# Altium project nombre_por_definir.PrjPcb
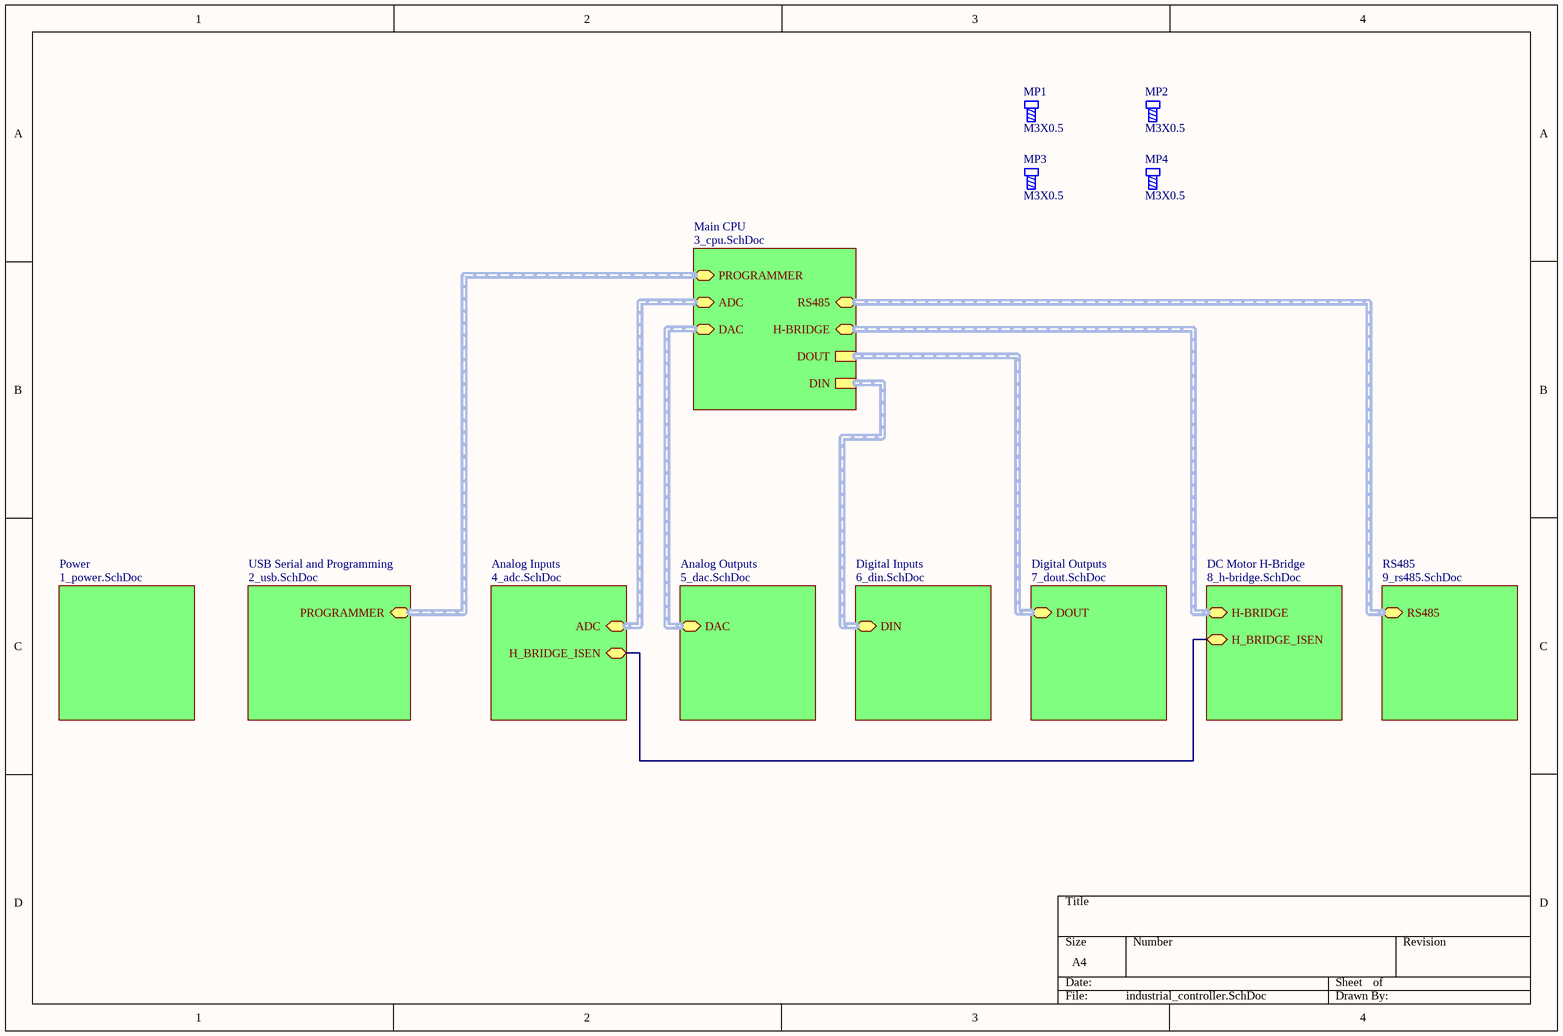
[diagram p0: industrial_controller.SchDoc]
10 sheets, 137 parts. Net scope: hierarchical (ports join the sheet entries above them; power ports are global).
Board file: nombre_por_definir.PcbDoc
Sheets:
  industrial_controller.SchDoc
    Main CPU = 3_cpu.SchDoc
    Analog Outputs = 5_dac.SchDoc
    Analog Inputs = 4_adc.SchDoc
    Power = 1_power.SchDoc
    RS485 = 9_rs485.SchDoc
    DC Motor H-Bridge = 8_h-bridge.SchDoc
    USB Serial and Programming = 2_usb.SchDoc
    Digital Inputs = 6_din.SchDoc
    Digital Outputs = 7_dout.SchDoc

## Sheet industrial_controller.SchDoc
size A4; DocumentNumber: 1; SheetNumber: 1; SheetTotal: 10

### Parts
MP1  M3X0.5  [SCREW-M3]  (no BOM)
MP2  M3X0.5  [SCREW-M3]  (no BOM)
MP3  M3X0.5  [SCREW-M3]  (no BOM)
MP4  M3X0.5  [SCREW-M3]  (no BOM)

### Sub-sheets
Analog Inputs = 4_adc.SchDoc: ADC (bidir, harness ADC), H_BRIDGE_ISEN (bidir)
Analog Outputs = 5_dac.SchDoc: DAC (bidir, harness DAC)
DC Motor H-Bridge = 8_h-bridge.SchDoc: H-BRIDGE (bidir, harness DC Motor H-Bridge), H_BRIDGE_ISEN (bidir)
Digital Inputs = 6_din.SchDoc: DIN (bidir, harness Digital Inputs)
Digital Outputs = 7_dout.SchDoc: DOUT (bidir, harness Digital Outputs)
Main CPU = 3_cpu.SchDoc: PROGRAMMER (bidir, harness ESP32 Programmer), RS485 (bidir, harness RS485), DAC (bidir, harness DAC), ADC (bidir, harness ADC), H-BRIDGE (bidir, harness DC Motor H-Bridge), DOUT (harness Digital Outputs), DIN (harness Digital Inputs)
Power = 1_power.SchDoc: no entries
RS485 = 9_rs485.SchDoc: RS485 (bidir, harness RS485)
USB Serial and Programming = 2_usb.SchDoc: PROGRAMMER (bidir, harness ESP32 Programmer)

### Nets
H_BRIDGE_ISEN: sheet Analog Inputs/H_BRIDGE_ISEN, sheet DC Motor H-Bridge/H_BRIDGE_ISEN

### Buses and harness runs
harness sheet Analog Inputs/ADC = sheet Main CPU/ADC
harness sheet Analog Outputs/DAC = sheet Main CPU/DAC
harness sheet DC Motor H-Bridge/H-BRIDGE = sheet Main CPU/H-BRIDGE
harness sheet Digital Inputs/DIN = sheet Main CPU/DIN
harness sheet Digital Outputs/DOUT = sheet Main CPU/DOUT
harness sheet Main CPU/PROGRAMMER = sheet USB Serial and Programming/PROGRAMMER
harness sheet Main CPU/RS485 = sheet RS485/RS485

### Library data of the parts
MP1-MP4 = SCREW-M3: Mach screw M3X0.5; Category: Accesories

## Sheet 3_cpu.SchDoc: Microcontroller
size A4; DocumentNumber: 4; SheetNumber: 4; SheetTotal: 11
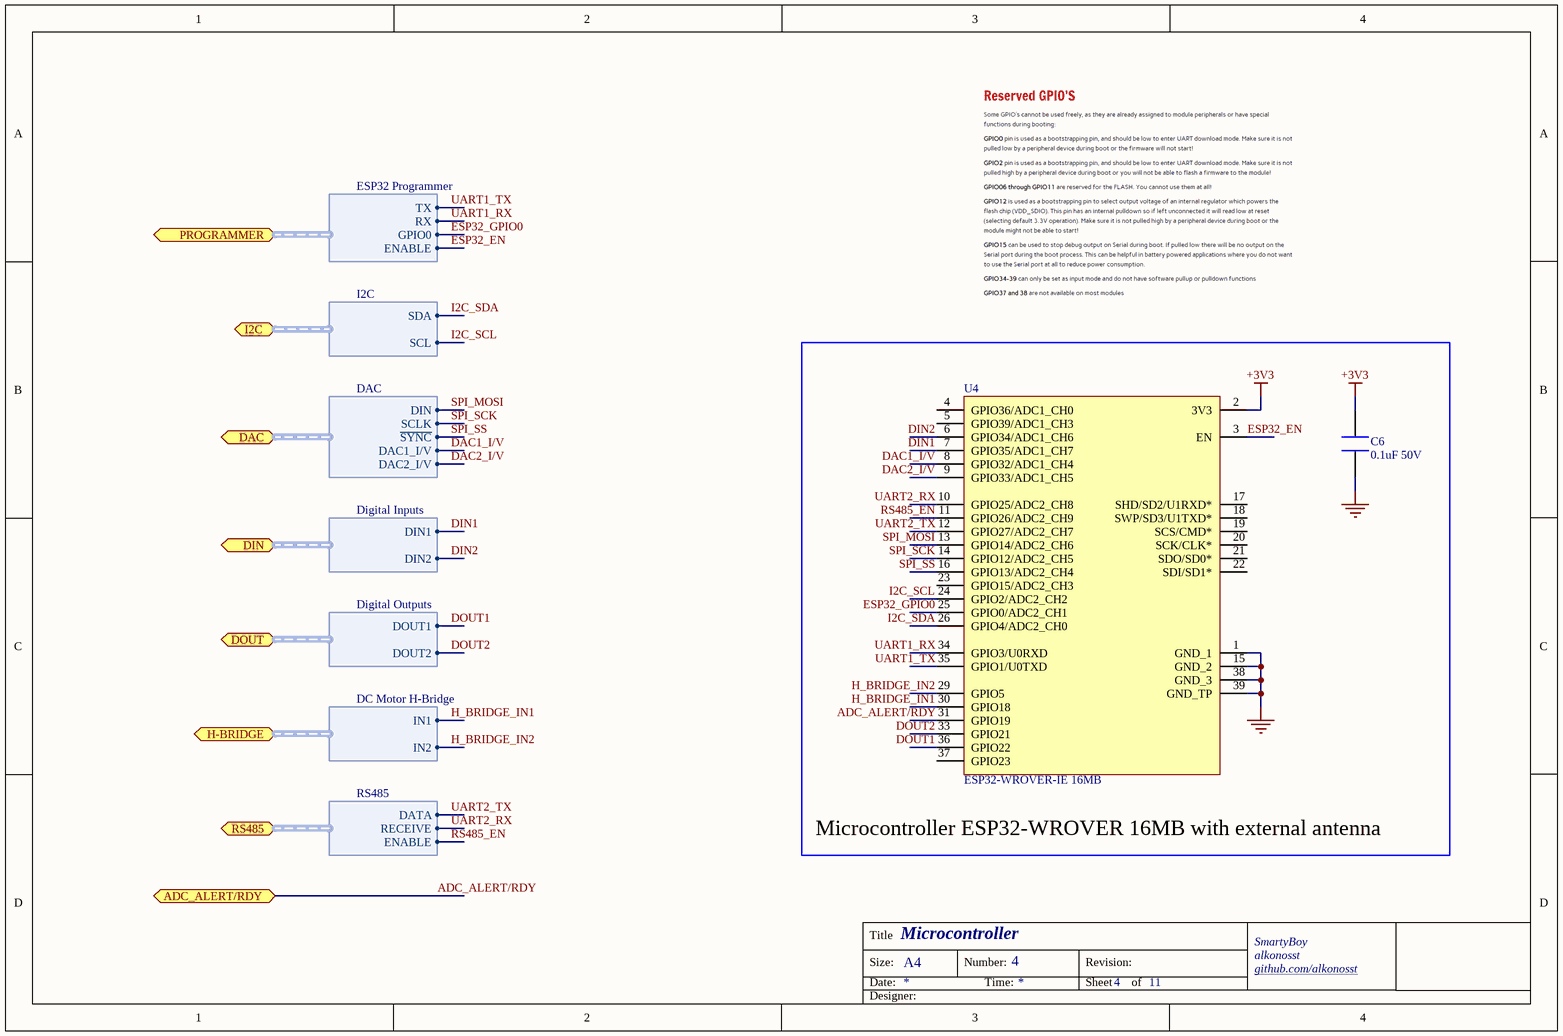
[diagram p1: 3_cpu.SchDoc]

### Parts
C6  0.1uF 50V  [C0603]
U4  ESP32-WROVER-IE 16MB  [ESP32-WROVER-IE]

### Blocks framed on the sheet
Microcontroller ESP32-WROVER 16MB with external antenna: C6 U4

### Ports
ADC_ALERT/RDY (bidir), DAC (bidir, harness DAC), DIN (bidir, harness Digital Inputs), DOUT (bidir, harness Digital Outputs), H-BRIDGE (bidir, harness DC Motor H-Bridge), I2C (bidir, harness I2C), PROGRAMMER (bidir, harness ESP32 Programmer), RS485 (bidir, harness RS485)

### Harnesses
ESP32 Programmer: TX, RX, GPIO0, ENABLE
RS485: DATA, RECEIVE, ENABLE
DAC: DIN, SCLK, ~{SYNC}, DAC1_I/V, DAC2_I/V
DC Motor H-Bridge: IN1, IN2
Digital Inputs: DIN1, DIN2
Digital Outputs: DOUT1, DOUT2
I2C: SDA, SCL

### Nets
+3V3: C6.1 U4.2(3V3)
GND: C6.2 U4.1(GND_1) U4.15(GND_2) U4.38(GND_3) U4.39(GND_TP)
ADC_ALERT/RDY: U4.31(GPIO19) ; port ADC_ALERT/RDY
DAC1_I/V: U4.8(GPIO32/ADC1_CH4) ; port DAC.DAC1_I/V
DAC2_I/V: U4.9(GPIO33/ADC1_CH5) ; port DAC.DAC2_I/V
DIN1: U4.7(GPIO35/ADC1_CH7) ; port DIN.DIN1
DIN2: U4.6(GPIO34/ADC1_CH6) ; port DIN.DIN2
DOUT1: U4.36(GPIO22) ; port DOUT.DOUT1
DOUT2: U4.33(GPIO21) ; port DOUT.DOUT2
ESP32_EN: U4.3(EN) ; port PROGRAMMER.ENABLE
ESP32_GPIO0: U4.25(GPIO0/ADC2_CH1) ; port PROGRAMMER.GPIO0
H_BRIDGE_IN1: U4.30(GPIO18) ; port H-BRIDGE.IN1
H_BRIDGE_IN2: U4.29(GPIO5) ; port H-BRIDGE.IN2
I2C_SCL: U4.24(GPIO2/ADC2_CH2) ; port I2C.SCL
I2C_SDA: U4.26(GPIO4/ADC2_CH0) ; port I2C.SDA
RS485_EN: U4.11(GPIO26/ADC2_CH9) ; port RS485.ENABLE
SPI_MOSI: U4.13(GPIO14/ADC2_CH6) ; port DAC.DIN
SPI_SCK: U4.14(GPIO12/ADC2_CH5) ; port DAC.SCLK
SPI_SS: U4.16(GPIO13/ADC2_CH4) ; port DAC.~{SYNC}
UART1_RX: U4.34(GPIO3/U0RXD) ; port PROGRAMMER.RX
UART1_TX: U4.35(GPIO1/U0TXD) ; port PROGRAMMER.TX
UART2_RX: U4.10(GPIO25/ADC2_CH8) ; port RS485.RECEIVE
UART2_TX: U4.12(GPIO27/ADC2_CH7) ; port RS485.DATA

Not connected (* = marked no-connect by the designer): U4 4(GPIO36/ADC1_CH0) 5(GPIO39/ADC1_CH3) 17(SHD/SD2/U1RXD*) 18(SWP/SD3/U1TXD*) 19(SCS/CMD*) 20(SCK/CLK*) 21(SDO/SD0*) 22(SDI/SD1*) 23(GPIO15/ADC2_CH3) 37(GPIO23)

### Notes on the sheet
- Title
- Size:
- Date:
- A4
- Number:
- Time:
- Revision:
- Sheet
- of
- SmartyBoy
- alkonosst
- github.com/alkonosst <http://github.com/alkonosst>
- Designer:

### Library data of the parts
C6 = CC0603KRX7R9BB104: X7R 100nF ±10% 50V 0603 Multilayer Ceramic Capacitors MLCC - SMD/SMT; LCSC part: C14663; Category: Capacitors: Multilayer Ceramic Capacitors MLCC - SMD/SMT
U4 = ESP32-WROVER-IE(16MB): RX TXRX MOD WIFI EXT IPEX SMD; LCSC part: C701352; Category: IoT/Communication Modules: WiFi Modules

## Sheet 5_dac.SchDoc: Analog Outputs
size A4; DocumentNumber: 6; SheetNumber: 6; SheetTotal: 11
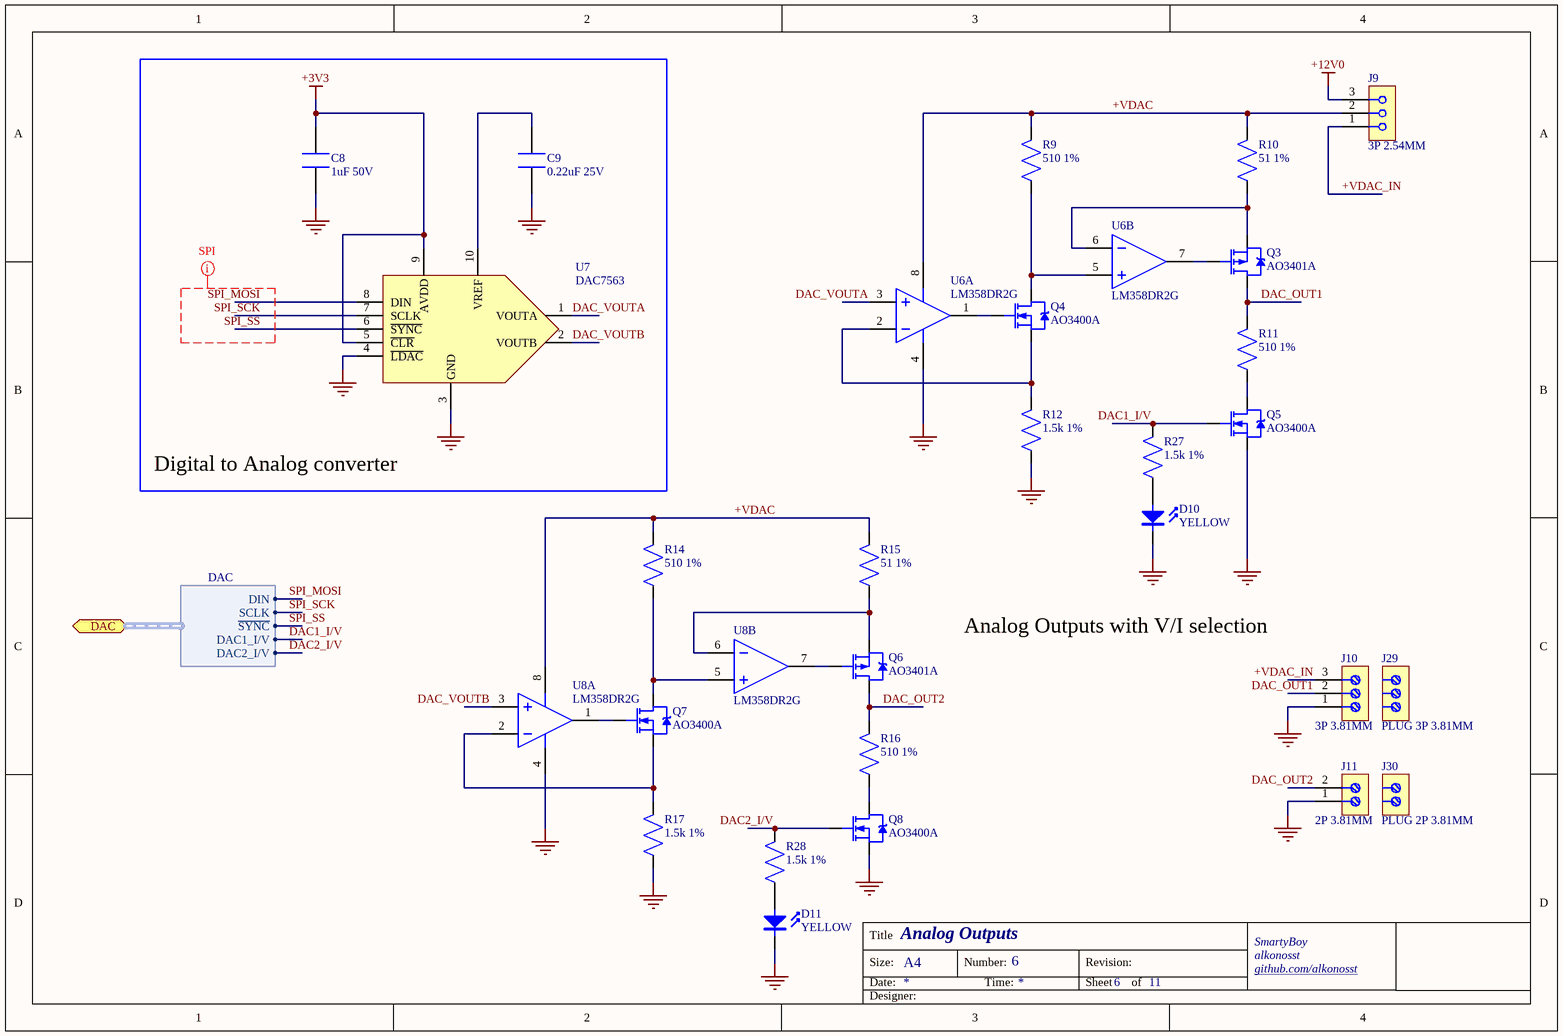
[diagram p2: 5_dac.SchDoc]

### Parts
C8  1uF 50V  [C0603]
C9  0.22uF 25V  [C0603]
D10  YELLOW  [LED0603-YELLOW]
D11  YELLOW  [LED0603-YELLOW]
J9  3P 2.54MM  [HDR-M-3P-2.54MM]
J10  3P 3.81MM  [TB-3P-3.81MM]  (no BOM)
J11  2P 3.81MM  [TB-2P-3.81MM]  (no BOM)
J29  PLUG 3P 3.81MM  [TB-PLUG-3P-3.81MM]  (no BOM)
J30  PLUG 2P 3.81MM  [TB-PLUG-2P-3.81MM]  (no BOM)
Q3  AO3401A  [SOT-23-3]
Q4  AO3400A  [SOT-23-3]
Q5  AO3400A  [SOT-23-3]
Q6  AO3401A  [SOT-23-3]
Q7  AO3400A  [SOT-23-3]
Q8  AO3400A  [SOT-23-3]
R9  510 1%  [R0603]
R10  51 1%  [R0603]
R11  510 1%  [R0603]
R12  1.5k 1%  [R0603]
R14  510 1%  [R0603]
R15  51 1%  [R0603]
R16  510 1%  [R0603]
R17  1.5k 1%  [R0603]
R27  1.5k 1%  [R0603]
R28  1.5k 1%  [R0603]
U6  LM358DR2G  [SOIC-8]  (parts A,B of 2)
U7  DAC7563  [VSSOP-10]
U8  LM358DR2G  [SOIC-8]  (parts A,B of 2)

### Blocks framed on the sheet
Digital to Analog converter: C8 C9 U7

### Ports
DAC (bidir, harness DAC)

### Harnesses
DAC: DIN, SCLK, ~{SYNC}, DAC1_I/V, DAC2_I/V

### Nets
+3V3: C8.1 U7.5(~{CLR}) U7.9(AVDD)
+12V0: J9.3
GND: C8.2 C9.2 D10.1 D11.1 J10.1 J11.1 Q5.2(S) Q8.2(S) R12.1 R17.1 U6.4(VSS) U7.3(GND) U7.4(~{LDAC}) U8.4(VSS)
+VDAC: J9.2 R9.2 R10.2 R14.2 R15.2 U6.8(VDD) U8.8(VDD)
+VDAC_IN: J9.1 J10.3
DAC1_I/V: Q5.1(G) R27.2 ; port DAC.DAC1_I/V
DAC2_I/V: Q8.1(G) R28.2 ; port DAC.DAC2_I/V
DAC_OUT1: J10.2 Q3.3(D) R11.2
DAC_OUT2: J11.2 Q6.3(D) R16.2
DAC_VOUTA: U6.3(IN1+) U7.1(VOUTA)
DAC_VOUTB: U7.2(VOUTB) U8.3(IN1+)
SPI_MOSI: U7.8(DIN) ; port DAC.DIN
SPI_SCK: U7.7(SCLK) ; port DAC.SCLK
SPI_SS: U7.6(~{SYNC}) ; port DAC.~{SYNC}
NetC9_1: C9.1 U7.10(VREF)
NetD10_2: D10.2 R27.1
NetD11_2: D11.2 R28.1
NetQ3_1: Q3.1(G) U6.7(OUT2)
NetQ3_2: Q3.2(S) R10.1 U6.6(IN2-)
NetQ4_1: Q4.1(G) U6.1(OUT1)
NetQ4_2: Q4.2(S) R12.2 U6.2(IN1-)
NetQ4_3: Q4.3(D) R9.1 U6.5(IN2+)
NetQ5_3: Q5.3(D) R11.1
NetQ6_1: Q6.1(G) U8.7(OUT2)
NetQ6_2: Q6.2(S) R15.1 U8.6(IN2-)
NetQ7_1: Q7.1(G) U8.1(OUT1)
NetQ7_2: Q7.2(S) R17.2 U8.2(IN1-)
NetQ7_3: Q7.3(D) R14.1 U8.5(IN2+)
NetQ8_3: Q8.3(D) R16.1

### Layout directives
net class SPI: SPI_MOSI, SPI_SCK, SPI_SS

### Notes on the sheet
- (near J10) Analog Outputs with V/I selection
- Title
- Size:
- Date:
- A4
- Number:
- Time:
- Revision:
- Sheet
- of
- SmartyBoy
- alkonosst
- github.com/alkonosst <http://github.com/alkonosst>
- Designer:

### Library data of the parts
C8 = CL10A105KB8NNNC: X5R ±10% 50V 1uF 0603 Multilayer Ceramic Capacitors MLCC - SMD/SMT; LCSC part: C15849; Category: Capacitors: Multilayer Ceramic Capacitors MLCC - SMD/SMT
C9 = CL10B224KA8NNNC: X7R 25V ±10% 220nF 0603 Multilayer Ceramic Capacitors MLCC - SMD/SMT; LCSC part: C21120; Category: Capacitors: Multilayer Ceramic Capacitors MLCC - SMD/SMT
D10 D11 = 19-213/Y2C-CQ2R2L/3T(CY): Yellow 585.5~591.5nm 0603 Light Emitting Diodes (LED); LCSC part: C72038; Category: Optoelectronics: Light Emitting Diodes (LED)
J9 = C49257: 3 2.54mm Straight 1 Header，Breakaway Through Hole Pin Header & Female Header; LCSC part: C49257; Category: Connectors: Pin Header & Female Header
J10 = TBLOCK-3P-3.81MM: Terminal Block 3 Positions 3.81MM; Category: Connectors: Pluggable System Terminal Block
J11 = TBLOCK-2P-3.81MM: Terminal Block 2 Positions 3.81MM; Category: Connectors: Pluggable System Terminal Block
J29 = PLUG-3P-3.81MM: Terminal block plug 3positions 3.81mm; Category: Connectors: Pluggable System Terminal Block
J30 = PLUG-2P-3.81MM: Terminal block plug 2positions 3.81mm; Category: Connectors: Pluggable System Terminal Block
Q3 Q6 = AO3401A: 1.4W 0.044Ω 4.3A,10V 30V 1.3V 250uA P Channel 4A SOT-23-3L MOSFETs; Category: Transistors: MOSFETs; LCSC part: C15127
Q4 Q5 Q7 Q8 = AO3400A: 1.4W 0.0265Ω 5.7A,10V 30V 5.7A N Channel 1.5V 250uA SOT-23-3L MOSFETs; LCSC part: C20917; Category: Transistors: MOSFETs
R9 R11 R14 R16 = 0603WAF5100T5E: 510Ω ±1% ±100ppm/℃ 0.1W 0603 Chip Resistor - Surface Mount; LCSC part: C23193; Category: Resistors: Chip Resistor - Surface Mount
R10 R15 = 0603WAF510JT5E: ±1% ±200ppm/℃ 0.1W 51Ω 0603 Chip Resistor - Surface Mount; LCSC part: C23197; Category: Resistors: Chip Resistor - Surface Mount
R12 R17 R27 R28 = 0603WAF1501T5E: 1.5kΩ ±1% ±100ppm/℃ 0.1W 0603 Chip Resistor - Surface Mount; LCSC part: C22843; Category: Resistors: Chip Resistor - Surface Mount
U6 U8 = LM358DR2G: 1MHz 2 General Purpose 1.5mA 0.6 V/us 3V ~ 32V, ±1.5V ~ 16V SOIC-8_150mil General Purpose Amplifiers; Category: Amplifiers: General Purpose Amplifiers; LCSC part: C7950
U7 = DAC7563SDGSR: VSSOP-10 Digital To Analog Converters (DACs); LCSC part: C601656; Category: Data Converters: Digital To Analog Converters (DACs)

## Sheet 4_adc.SchDoc: Analog Inputs
size A4; DocumentNumber: 5; SheetNumber: 5; SheetTotal: 11
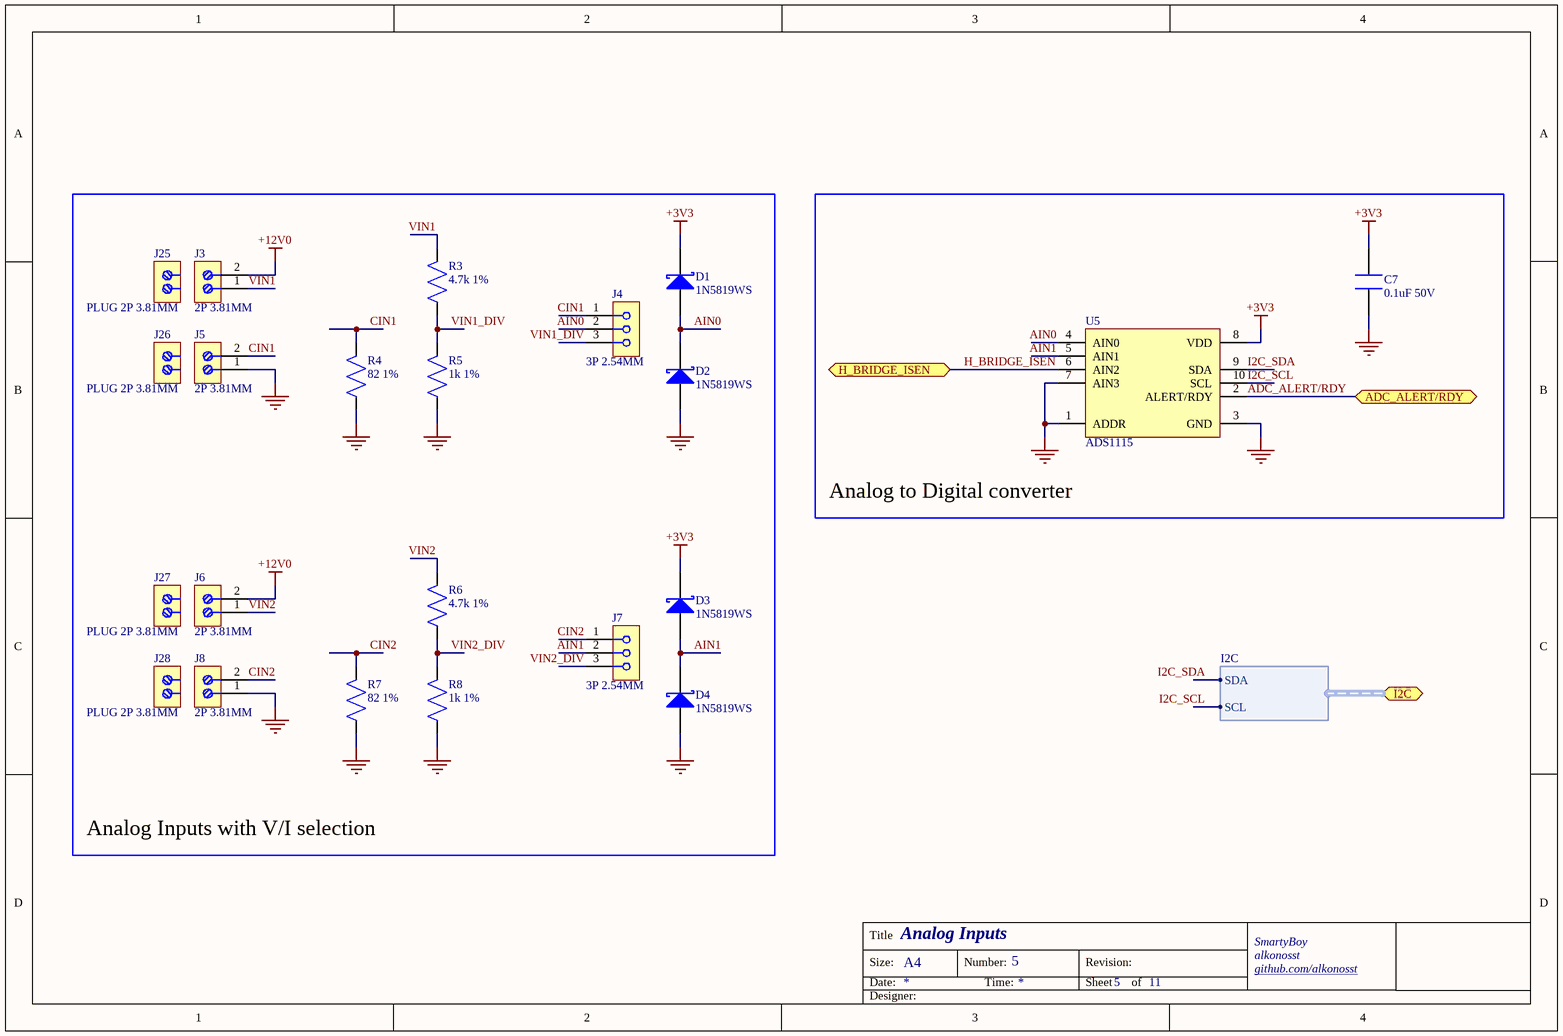
[diagram p3: 4_adc.SchDoc]

### Parts
C7  0.1uF 50V  [C0603]
D1  1N5819WS  [SOD-323]
D2  1N5819WS  [SOD-323]
D3  1N5819WS  [SOD-323]
D4  1N5819WS  [SOD-323]
J3  2P 3.81MM  [TB-2P-3.81MM]  (no BOM)
J4  3P 2.54MM  [HDR-M-3P-2.54MM]
J5  2P 3.81MM  [TB-2P-3.81MM]  (no BOM)
J6  2P 3.81MM  [TB-2P-3.81MM]  (no BOM)
J7  3P 2.54MM  [HDR-M-3P-2.54MM]
J8  2P 3.81MM  [TB-2P-3.81MM]  (no BOM)
J25  PLUG 2P 3.81MM  [TB-PLUG-2P-3.81MM]  (no BOM)
J26  PLUG 2P 3.81MM  [TB-PLUG-2P-3.81MM]  (no BOM)
J27  PLUG 2P 3.81MM  [TB-PLUG-2P-3.81MM]  (no BOM)
J28  PLUG 2P 3.81MM  [TB-PLUG-2P-3.81MM]  (no BOM)
R3  4.7k 1%  [R0603]
R4  82 1%  [R0603]
R5  1k 1%  [R0603]
R6  4.7k 1%  [R0603]
R7  82 1%  [R0603]
R8  1k 1%  [R0603]
U5  ADS1115  [MSOP-10]

### Blocks framed on the sheet
Analog Inputs with V/I selection: D1-D4 J3-J8 J25-J28 R3-R8
Analog to Digital converter: C7 U5

### Ports
ADC_ALERT/RDY (bidir), H_BRIDGE_ISEN (bidir), I2C (bidir, harness I2C)

### Harnesses
I2C: SDA, SCL

### Nets
+3V3: C7.1 D1.1(K) D3.1(K) U5.8(VDD)
+12V0: J3.2 J6.2
GND: C7.2 D2.2(A) D4.2(A) J5.1 J8.1 R4.1 R5.1 R7.1 R8.1 U5.1(ADDR) U5.3(GND) U5.7(AIN3)
ADC_ALERT/RDY: U5.2(ALERT/RDY) ; port ADC_ALERT/RDY
AIN0: D1.2(A) D2.1(K) J4.2 U5.4(AIN0)
AIN1: D3.2(A) D4.1(K) J7.2 U5.5(AIN1)
CIN1: J4.1 J5.2 R4.2
CIN2: J7.1 J8.2 R7.2
H_BRIDGE_ISEN: U5.6(AIN2) ; port H_BRIDGE_ISEN
I2C_SCL: U5.10(SCL) ; port I2C.SCL
I2C_SDA: U5.9(SDA) ; port I2C.SDA
VIN1: J3.1 R3.2
VIN1_DIV: J4.3 R3.1 R5.2
VIN2: J6.1 R6.2
VIN2_DIV: J7.3 R6.1 R8.2

### Notes on the sheet
- Title
- Size:
- Date:
- A4
- Number:
- Time:
- Revision:
- Sheet
- of
- SmartyBoy
- alkonosst
- github.com/alkonosst <http://github.com/alkonosst>
- Designer:

### Library data of the parts
C7 = CC0603KRX7R9BB104: as C6 on sheet 3_cpu; LCSC part: C14663; Category: Capacitors: Multilayer Ceramic Capacitors MLCC - SMD/SMT
D1-D4 = 1N5819WS: 40V 1A 600mV @ 1A SOD-323 Schottky Barrier Diodes (SBD); LCSC part: C191023; Category: Diodes: Schottky Barrier Diodes (SBD)
J3 J5 J6 J8 = TBLOCK-2P-3.81MM: Terminal Block 2 Positions 3.81MM; Category: Connectors: Pluggable System Terminal Block
J4 J7 = C49257: as J9 on sheet 5_dac; LCSC part: C49257; Category: Connectors: Pin Header & Female Header
J25-J28 = PLUG-2P-3.81MM: Terminal block plug 2positions 3.81mm; Category: Connectors: Pluggable System Terminal Block
R3 R6 = 0603WAF4701T5E: ±1% 4.7kΩ ±100ppm/℃ 0.1W 0603 Chip Resistor - Surface Mount; LCSC part: C23162; Category: Resistors: Chip Resistor - Surface Mount
R4 R7 = 0603WAF820JT5E: 82Ω ±1% ±200ppm/℃ 0.1W 0603 Chip Resistor - Surface Mount; LCSC part: C23255; Category: Resistors: Chip Resistor - Surface Mount
R5 R8 = 0603WAF1001T5E: ±1% ±100ppm/℃ 1kΩ 0.1W 0603 Chip Resistor - Surface Mount; LCSC part: C21190; Category: Resistors: Chip Resistor - Surface Mount
U5 = ADS1115IDGSR: 2,4 Differential, Single Ended 16 860 VSSOP-10 Analog To Digital Converters (ADCs); LCSC part: C37593; Category: Data Converters: Analog To Digital Converters (ADCs)

## Sheet 1_power.SchDoc: Power
size A4; DocumentNumber: 2; SheetNumber: 2; SheetTotal: 11
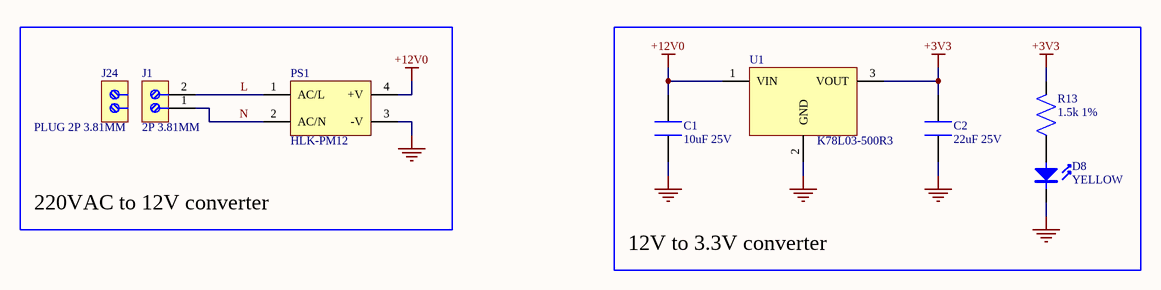
[diagram p4: 1_power.SchDoc]

### Parts
C1  10uF 25V  [C0805]
C2  22uF 25V  [C0805]
D8  YELLOW  [LED0603-YELLOW]
J1  2P 3.81MM  [TB-2P-3.81MM]  (no BOM)
J24  PLUG 2P 3.81MM  [TB-PLUG-2P-3.81MM]  (no BOM)
PS1  HLK-PM12  [HLK-PM12]
R13  1.5k 1%  [R0603]
U1  K78L03-500R3  [K78LXX-500R3]

### Blocks framed on the sheet
220VAC to 12V converter: J1 J24 PS1
12V to 3.3V converter: C1 C2 D8 R13 U1

### Nets
+3V3: C2.1 R13.2 U1.3(VOUT)
+12V0: C1.1 PS1.4(+V) U1.1(VIN)
GND: C1.2 C2.2 D8.1 PS1.3(-V) U1.2(GND)
L: J1.2 PS1.1(AC/L)
N: J1.1 PS1.2(AC/N)
NetD8_2: D8.2 R13.1

### Notes on the sheet
- Title
- Size:
- Date:
- A4
- Number:
- Time:
- Revision:
- Sheet
- of
- SmartyBoy
- alkonosst
- github.com/alkonosst <http://github.com/alkonosst>
- Designer:

### Library data of the parts
C1 = CL21A106KAYNNNE: X5R 25V ±10% 10uF 0805 Multilayer Ceramic Capacitors MLCC - SMD/SMT; LCSC part: C15850; Category: Capacitors: Multilayer Ceramic Capacitors MLCC - SMD/SMT
C2 = CL21A226MAQNNNE: X5R 25V ±20% 22uF 0805 Multilayer Ceramic Capacitors MLCC - SMD/SMT; LCSC part: C45783; Category: Capacitors: Multilayer Ceramic Capacitors MLCC - SMD/SMT
D8 = 19-213/Y2C-CQ2R2L/3T(CY): as D10 on sheet 5_dac; LCSC part: C72038; Category: Optoelectronics: Light Emitting Diodes (LED)
J1 = TBLOCK-2P-3.81MM: Terminal Block 2 Positions 3.81MM; Category: Connectors: Pluggable System Terminal Block
J24 = PLUG-2P-3.81MM: Terminal block plug 2positions 3.81mm; Category: Connectors: Pluggable System Terminal Block
PS1 = HLK-PM12: 220VAC to 12VDC Power Module 3W; LCSC part: C209905; Category: Power Management ICs: Power Modules
R13 = 0603WAF1501T5E: as R12 on sheet 5_dac; LCSC part: C22843; Category: Resistors: Chip Resistor - Surface Mount
U1 = K78L03-500R3: 36V 500mA 3.3V 1 SIP Power Modules; LCSC part: C115818; Category: Power Management ICs: Power Modules

## Sheet 9_rs485.SchDoc: RS485 Bus
size A4; DocumentNumber: 10; SheetNumber: 10; SheetTotal: 11
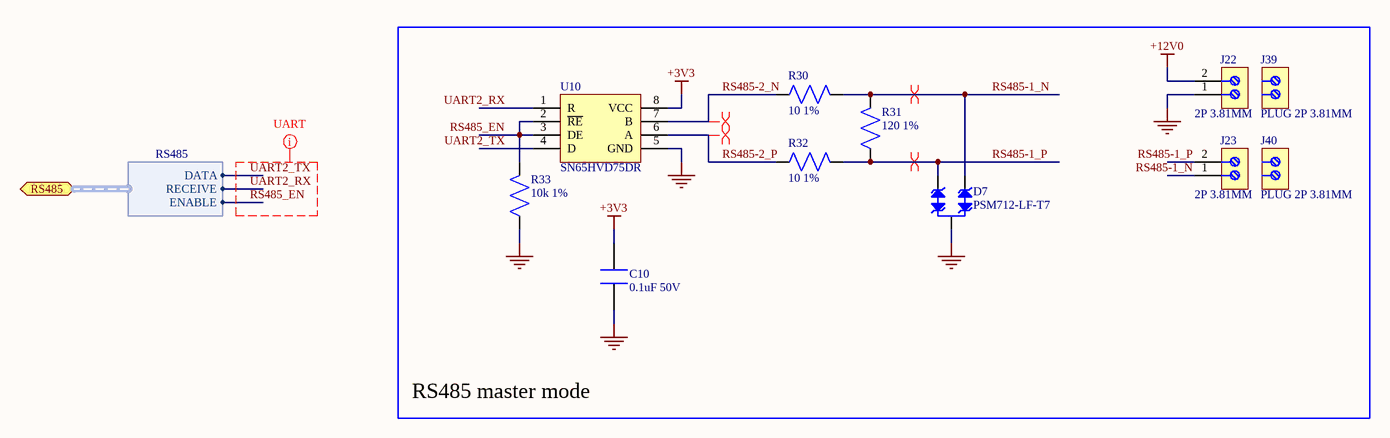
[diagram p5: 9_rs485.SchDoc]

### Parts
C10  0.1uF 50V  [C0603]
D7  PSM712-LF-T7  [SOT-23-3]
J22  2P 3.81MM  [TB-2P-3.81MM]  (no BOM)
J23  2P 3.81MM  [TB-2P-3.81MM]  (no BOM)
J39  PLUG 2P 3.81MM  [TB-PLUG-2P-3.81MM]  (no BOM)
J40  PLUG 2P 3.81MM  [TB-PLUG-2P-3.81MM]  (no BOM)
R30  10 1%  [R0603]
R31  120 1%  [R0603]
R32  10 1%  [R0603]
R33  10k 1%  [R0603]
U10  SN65HVD75DR  [SOIC-8]

### Blocks framed on the sheet
RS485 master mode: C10 D7 J22 J23 J39 J40 R30-R33 U10

### Ports
RS485 (bidir, harness RS485)

### Harnesses
RS485: DATA, RECEIVE, ENABLE

### Nets
+3V3: C10.1 U10.8(VCC)
+12V0: J22.2
GND: C10.2 D7.3 J22.1 R33.1 U10.5(GND)
RS485-1_N: D7.2 J23.1 R30.2 R31.2
RS485-1_P: D7.1 J23.2 R31.1 R32.2
RS485-2_N: R30.1 U10.7(B)
RS485-2_P: R32.1 U10.6(A)
RS485_EN: R33.2 U10.2(~{RE}) U10.3(DE) ; port RS485.ENABLE
UART2_RX: U10.1(R) ; port RS485.RECEIVE
UART2_TX: U10.4(D) ; port RS485.DATA

### Layout directives
differential pair: RS485-1_N, RS485-1_P, RS485-2_N, RS485-2_P
net class UART: RS485_EN, UART2_RX, UART2_TX

### Notes on the sheet
- Title
- Size:
- Date:
- A4
- Number:
- Time:
- Revision:
- Sheet
- of
- SmartyBoy
- alkonosst
- github.com/alkonosst <http://github.com/alkonosst>
- Designer:

### Library data of the parts
C10 = CC0603KRX7R9BB104: as C6 on sheet 3_cpu; LCSC part: C14663; Category: Capacitors: Multilayer Ceramic Capacitors MLCC - SMD/SMT
D7 = PSM712-LF-T7: Bidirectional - 19V 13.3V 12V SOT-23(SOT-23-3) TVS; Category: Diodes: TVS; LCSC part: C32677
J22 J23 = TBLOCK-2P-3.81MM: Terminal Block 2 Positions 3.81MM; Category: Connectors: Pluggable System Terminal Block
J39 J40 = PLUG-2P-3.81MM: Terminal block plug 2positions 3.81mm; Category: Connectors: Pluggable System Terminal Block
R30 R32 = 0603WAF100JT5E: ±1% ±400ppm/℃ 10Ω 0.1W 0603 Chip Resistor - Surface Mount; LCSC part: C22859; Category: Resistors: Chip Resistor - Surface Mount
R31 = 0603WAF1200T5E: ±1% ±100ppm/℃ 120Ω 0.1W 0603 Chip Resistor - Surface Mount; LCSC part: C22787; Category: Resistors: Chip Resistor - Surface Mount
R33 = 0603WAF1002T5E: ±1% ±100ppm/℃ 10kΩ 0.1W 0603 Chip Resistor - Surface Mount; LCSC part: C25804; Category: Resistors: Chip Resistor - Surface Mount
U10 = SN65HVD75DR: Transceiver 1/1 RS422, RS485 20Mbps SOIC-8_150mil RS-485/RS-422 ICs; LCSC part: C57928; Category: Interface ICs: RS-485/RS-422 ICs

## Sheet 8_h-bridge.SchDoc: H-Bridge DC Motor
size A4; DocumentNumber: 9; SheetNumber: 9; SheetTotal: 11
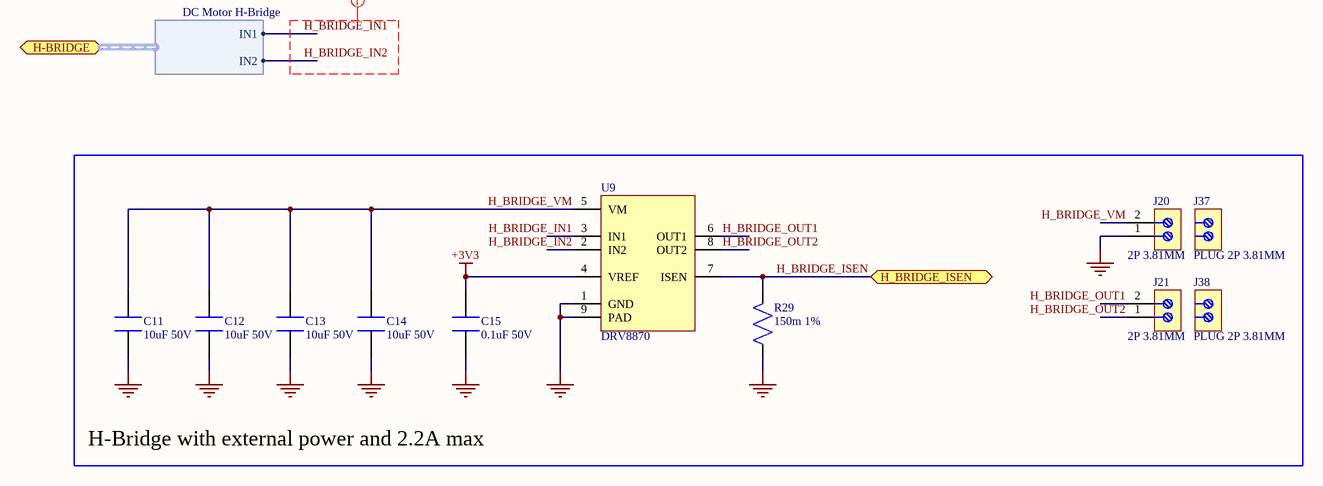
[diagram p6: 8_h-bridge.SchDoc]

### Parts
C11  10uF 50V  [C0805]
C12  10uF 50V  [C0805]
C13  10uF 50V  [C0805]
C14  10uF 50V  [C0805]
C15  0.1uF 50V  [C0603]
J20  2P 3.81MM  [TB-2P-3.81MM]  (no BOM)
J21  2P 3.81MM  [TB-2P-3.81MM]  (no BOM)
J37  PLUG 2P 3.81MM  [TB-PLUG-2P-3.81MM]  (no BOM)
J38  PLUG 2P 3.81MM  [TB-PLUG-2P-3.81MM]  (no BOM)
R29  150m 1%  [R2512]
U9  DRV8870  [HSOP-8]

### Blocks framed on the sheet
H-Bridge with external power and 2.2A max: C11-C15 J20 J21 J37 J38 R29 U9

### Ports
H-BRIDGE (bidir, harness DC Motor H-Bridge), H_BRIDGE_ISEN (bidir)

### Harnesses
DC Motor H-Bridge: IN1, IN2

### Nets
+3V3: C15.1 U9.4(VREF)
GND: C11.2 C12.2 C13.2 C14.2 C15.2 J20.1 R29.1 U9.1(GND) U9.9(PAD)
H_BRIDGE_IN1: U9.3(IN1) ; port H-BRIDGE.IN1
H_BRIDGE_IN2: U9.2(IN2) ; port H-BRIDGE.IN2
H_BRIDGE_ISEN: R29.2 U9.7(ISEN) ; port H_BRIDGE_ISEN
H_BRIDGE_OUT1: J21.2 U9.6(OUT1)
H_BRIDGE_OUT2: J21.1 U9.8(OUT2)
H_BRIDGE_VM: C11.1 C12.1 C13.1 C14.1 J20.2 U9.5(VM)

### Layout directives
net class H_BRIDGE_PWM: H_BRIDGE_IN1, H_BRIDGE_IN2

### Notes on the sheet
- Title
- Size:
- Date:
- A4
- Number:
- Time:
- Revision:
- Sheet
- of
- SmartyBoy
- alkonosst
- github.com/alkonosst <http://github.com/alkonosst>
- Designer:

### Library data of the parts
C11-C14 = GRM21BR61H106KE43L: X5R ±10% 50V 10uF 0805 Multilayer Ceramic Capacitors MLCC - SMD/SMT; LCSC part: C440198; Category: Capacitors: Multilayer Ceramic Capacitors MLCC - SMD/SMT
C15 = CC0603KRX7R9BB104: as C6 on sheet 3_cpu; LCSC part: C14663; Category: Capacitors: Multilayer Ceramic Capacitors MLCC - SMD/SMT
J20 J21 = TBLOCK-2P-3.81MM: Terminal Block 2 Positions 3.81MM; Category: Connectors: Pluggable System Terminal Block
J37 J38 = PLUG-2P-3.81MM: Terminal block plug 2positions 3.81mm; Category: Connectors: Pluggable System Terminal Block
R29 = MA251220FR150FZ: ±1% 0.15Ω ±50ppm/℃ 2W 2512 Current Sense Resistors/Shunt Resistors; LCSC part: C252673; Category: Resistors: Current Sense Resistors/Shunt Resistors
U9 = DRV8870DDAR: HSOP-8 Motor Driver ICs; LCSC part: C86590; Category: Power Management ICs: Motor Driver ICs

## Sheet 2_usb.SchDoc: USB
size A4; DocumentNumber: 3; SheetNumber: 3; SheetTotal: 11
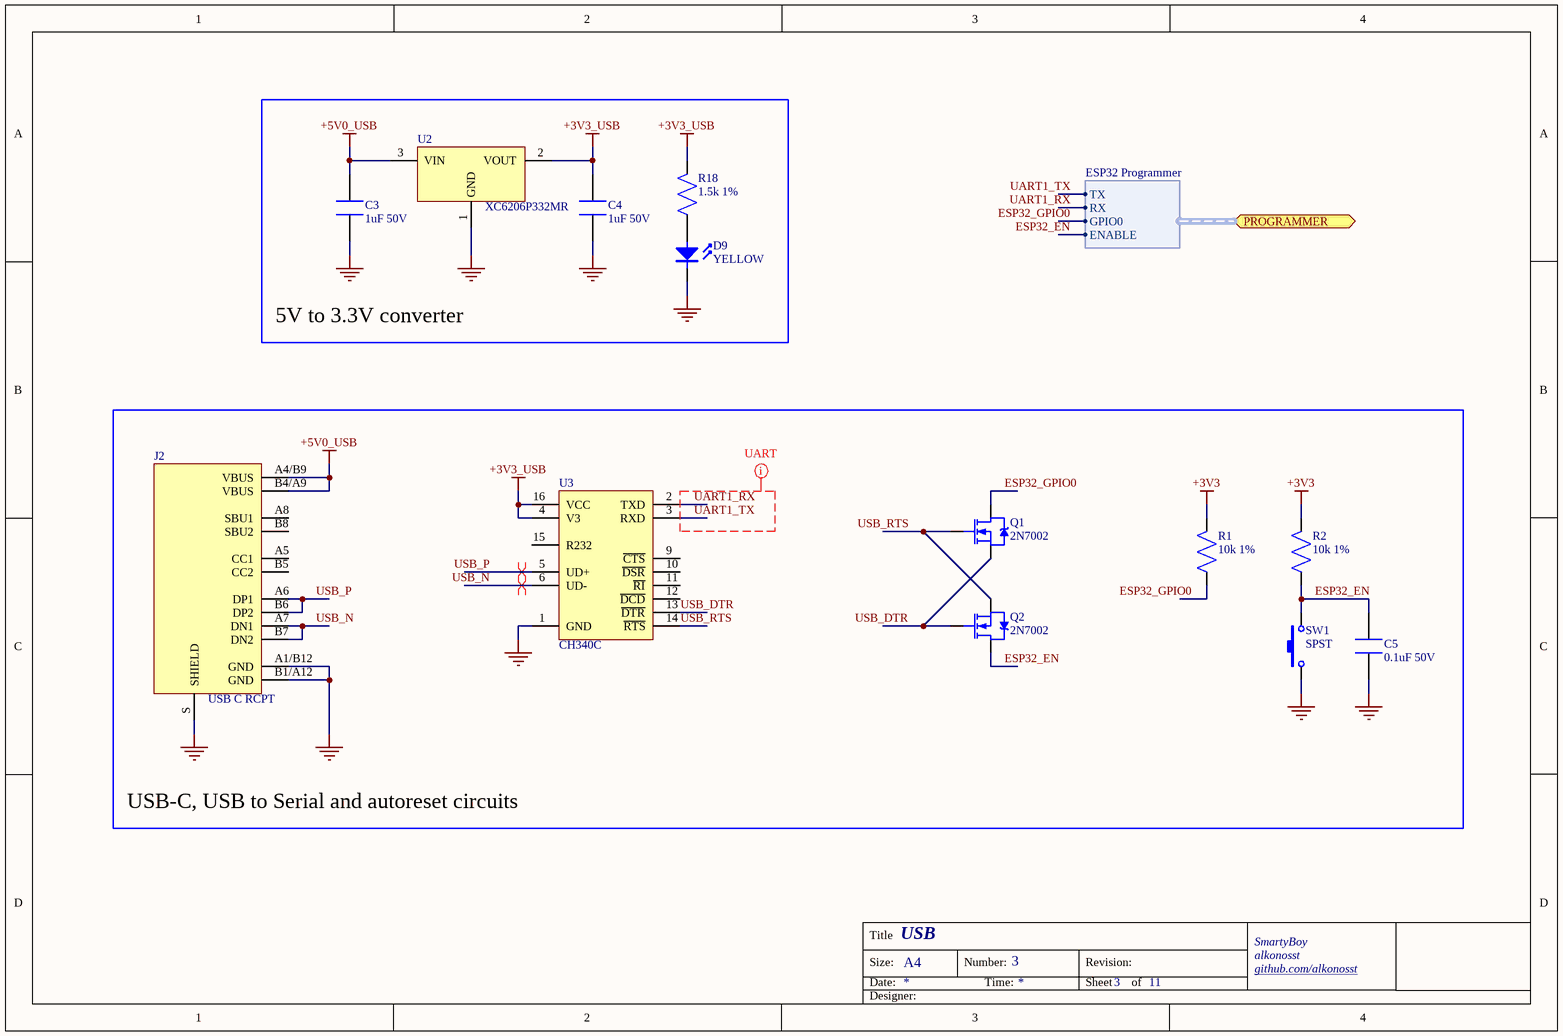
[diagram p7: 2_usb.SchDoc]

### Parts
C3  1uF 50V  [C0603]
C4  1uF 50V  [C0603]
C5  0.1uF 50V  [C0603]
D9  YELLOW  [LED0603-YELLOW]
J2  USB C RCPT  [USB-TYPE-C-RCPT]
Q1  2N7002  [SOT-23-3]
Q2  2N7002  [SOT-23-3]
R1  10k 1%  [R0603]
R2  10k 1%  [R0603]
R18  1.5k 1%  [R0603]
SW1  SPST  [SW-TS-1187A-B-A-B]
U2  XC6206P332MR  [SOT-23-3]
U3  CH340C  [SOP-16]

### Blocks framed on the sheet
5V to 3.3V converter: C3 C4 D9 R18 U2
USB-C, USB to Serial and autoreset circuits: C5 J2 Q1 Q2 R1 R2 SW1 U3

### Ports
PROGRAMMER (bidir, harness ESP32 Programmer)

### Harnesses
ESP32 Programmer: TX, RX, GPIO0, ENABLE

### Nets
+3V3: R1.2 R2.2
+3V3_USB: C4.1 R18.2 U2.2(VOUT) U3.4(V3) U3.16(VCC)
+5V0_USB: C3.1 J2.A4/B9(VBUS) J2.B4/A9(VBUS) U2.3(VIN)
GND: C3.2 C4.2 C5.2 D9.1 J2.A1/B12(GND) J2.B1/A12(GND) J2.S(SHIELD) SW1.1 U2.1(GND) U3.1(GND)
ESP32_EN: C5.1 Q2.3(D) R2.1 SW1.2 ; port PROGRAMMER.ENABLE
ESP32_GPIO0: Q1.3(D) R1.1 ; port PROGRAMMER.GPIO0
UART1_RX: U3.2(TXD) ; port PROGRAMMER.RX
UART1_TX: U3.3(RXD) ; port PROGRAMMER.TX
USB_DTR: Q1.2(S) Q2.1(G) U3.13(~{DTR})
USB_N: J2.A7(DN1) J2.B7(DN2) U3.6(UD-)
USB_P: J2.A6(DP1) J2.B6(DP2) U3.5(UD+)
USB_RTS: Q1.1(G) Q2.2(S) U3.14(~{RTS})
NetD9_2: D9.2 R18.1

Not connected (* = marked no-connect by the designer): J2 A5(CC1) A8(SBU1) B5(CC2) B8(SBU2); U3 7(NC1) 8(NC2) 9(~{CTS}) 10(~{DSR}) 11(~{RI}) 12(~{DCD}) 15(R232)

### Layout directives
differential pair: USB_N, USB_P
net class UART: UART1_RX, UART1_TX

### Notes on the sheet
- Title
- Size:
- Date:
- A4
- Number:
- Time:
- Revision:
- Sheet
- of
- SmartyBoy
- alkonosst
- github.com/alkonosst <http://github.com/alkonosst>
- Designer:

### Library data of the parts
C3 C4 = CL10A105KB8NNNC: as C8 on sheet 5_dac; LCSC part: C15849; Category: Capacitors: Multilayer Ceramic Capacitors MLCC - SMD/SMT
C5 = CC0603KRX7R9BB104: as C6 on sheet 3_cpu; LCSC part: C14663; Category: Capacitors: Multilayer Ceramic Capacitors MLCC - SMD/SMT
D9 = 19-213/Y2C-CQ2R2L/3T(CY): as D10 on sheet 5_dac; LCSC part: C72038; Category: Optoelectronics: Light Emitting Diodes (LED)
J2 = TYPE-C-31-M-12: Receptacle USB Type C 16 Pins; LCSC part: C165948; Category: Connectors: USB Connectors
Q1 Q2 = 2N7002: 2.5V 250uA 0.115A 60V N Channel 7.5Ω 500mA,10V 0.2W SOT-23(SOT-23-3) MOSFETs; LCSC part: C8545; Category: Transistors: MOSFETs
R1 R2 = 0603WAF1002T5E: as R33 on sheet 9_rs485; LCSC part: C25804; Category: Resistors: Chip Resistor - Surface Mount
R18 = 0603WAF1501T5E: as R12 on sheet 5_dac; LCSC part: C22843; Category: Resistors: Chip Resistor - Surface Mount
SW1 = TS-1187A-B-A-B: Top Actuated 50mA @ 12VDC Round Button 160gf SPST SMD Tactile Switches; LCSC part: C318884; Category: Pushbutton Switches & Relays: Tactile Switches
U2 = XC6206P332MR: 6V 680mV @ 100mA Fixed 3.3V SOT-23-3L Linear Voltage Regulators (LDO); LCSC part: C5446; Category: Power Management ICs: Linear Voltage Regulators (LDO)
U3 = CH340C: USB 2.0 Transceiver 2Mbps SOP-16_150mil USB ICs ROHS; LCSC part: C84681; Category: Interface ICs: USB ICs

## Sheet 6_din.SchDoc: Digital Inputs
size A4; DocumentNumber: 7; SheetNumber: 7; SheetTotal: 11
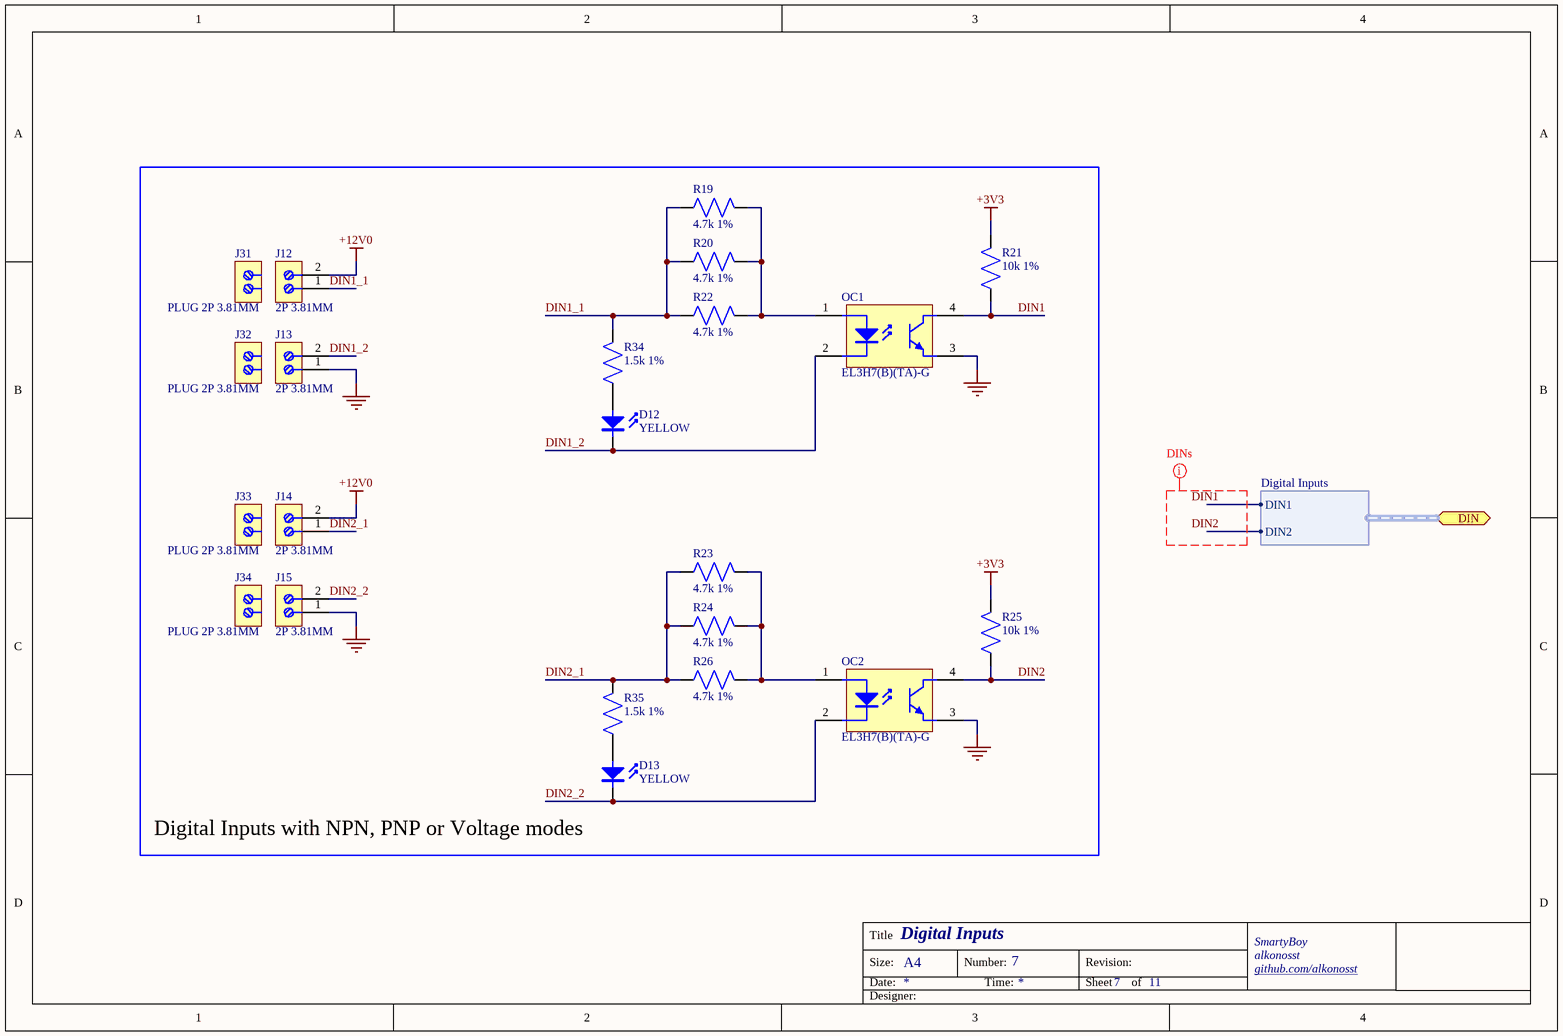
[diagram p8: 6_din.SchDoc]

### Parts
D12  YELLOW  [LED0603-YELLOW]
D13  YELLOW  [LED0603-YELLOW]
J12  2P 3.81MM  [TB-2P-3.81MM]  (no BOM)
J13  2P 3.81MM  [TB-2P-3.81MM]  (no BOM)
J14  2P 3.81MM  [TB-2P-3.81MM]  (no BOM)
J15  2P 3.81MM  [TB-2P-3.81MM]  (no BOM)
J31  PLUG 2P 3.81MM  [TB-PLUG-2P-3.81MM]  (no BOM)
J32  PLUG 2P 3.81MM  [TB-PLUG-2P-3.81MM]  (no BOM)
J33  PLUG 2P 3.81MM  [TB-PLUG-2P-3.81MM]  (no BOM)
J34  PLUG 2P 3.81MM  [TB-PLUG-2P-3.81MM]  (no BOM)
OC1  EL3H7(B)(TA)-G  [SSOP-4]
OC2  EL3H7(B)(TA)-G  [SSOP-4]
R19  4.7k 1%  [R1206]
R20  4.7k 1%  [R1206]
R21  10k 1%  [R0603]
R22  4.7k 1%  [R1206]
R23  4.7k 1%  [R1206]
R24  4.7k 1%  [R1206]
R25  10k 1%  [R0603]
R26  4.7k 1%  [R1206]
R34  1.5k 1%  [R0603]
R35  1.5k 1%  [R0603]

### Blocks framed on the sheet
Digital Inputs with NPN, PNP or Voltage modes: D12 D13 J12-J15 J31-J34 OC1 OC2 R19-R26 R34 R35

### Ports
DIN (bidir, harness Digital Inputs)

### Harnesses
Digital Inputs: DIN1, DIN2

### Nets
+3V3: R21.2 R25.2
+12V0: J12.2 J14.2
GND: J13.1 J15.1 OC1.3(E) OC2.3(E)
DIN1: OC1.4(C) R21.1 ; port DIN.DIN1
DIN1_1: J12.1 R19.1 R20.1 R22.1 R34.2
DIN1_2: D12.1 J13.2 OC1.2(K)
DIN2: OC2.4(C) R25.1 ; port DIN.DIN2
DIN2_1: J14.1 R23.1 R24.1 R26.1 R35.2
DIN2_2: D13.1 J15.2 OC2.2(K)
NetD12_2: D12.2 R34.1
NetD13_2: D13.2 R35.1
NetOC1_1: OC1.1(A) R19.2 R20.2 R22.2
NetOC2_1: OC2.1(A) R23.2 R24.2 R26.2

### Layout directives
net class DINs: DIN1, DIN2

### Notes on the sheet
- Title
- Size:
- Date:
- A4
- Number:
- Time:
- Revision:
- Sheet
- of
- SmartyBoy
- alkonosst
- github.com/alkonosst <http://github.com/alkonosst>
- Designer:

### Library data of the parts
D12 D13 = 19-213/Y2C-CQ2R2L/3T(CY): as D10 on sheet 5_dac; LCSC part: C72038; Category: Optoelectronics: Light Emitting Diodes (LED)
J12-J15 = TBLOCK-2P-3.81MM: Terminal Block 2 Positions 3.81MM; Category: Connectors: Pluggable System Terminal Block
J31-J34 = PLUG-2P-3.81MM: Terminal block plug 2positions 3.81mm; Category: Connectors: Pluggable System Terminal Block
OC1 OC2 = EL3H7(B)(TA)-G: 1 3750Vrms TransistorOptocouplers DC SOP-4_P1.27 Optocouplers - Phototransistor Output; LCSC part: C32565; Category: Optoelectronics: Optocouplers - Phototransistor Output
R19 R20 R22-R24 R26 = 1206W4F4701T5E: 0.25W ±1% 4.7kΩ ±100ppm/℃ 1206 Chip Resistor - Surface Mount; LCSC part: C17936; Category: Resistors: Chip Resistor - Surface Mount
R21 R25 = 0603WAF1002T5E: as R33 on sheet 9_rs485; LCSC part: C25804; Category: Resistors: Chip Resistor - Surface Mount
R34 R35 = 0603WAF1501T5E: as R12 on sheet 5_dac; LCSC part: C22843; Category: Resistors: Chip Resistor - Surface Mount

## Sheet 7_dout.SchDoc: Digital Outputs
size A4; DocumentNumber: 8; SheetNumber: 8; SheetTotal: 11
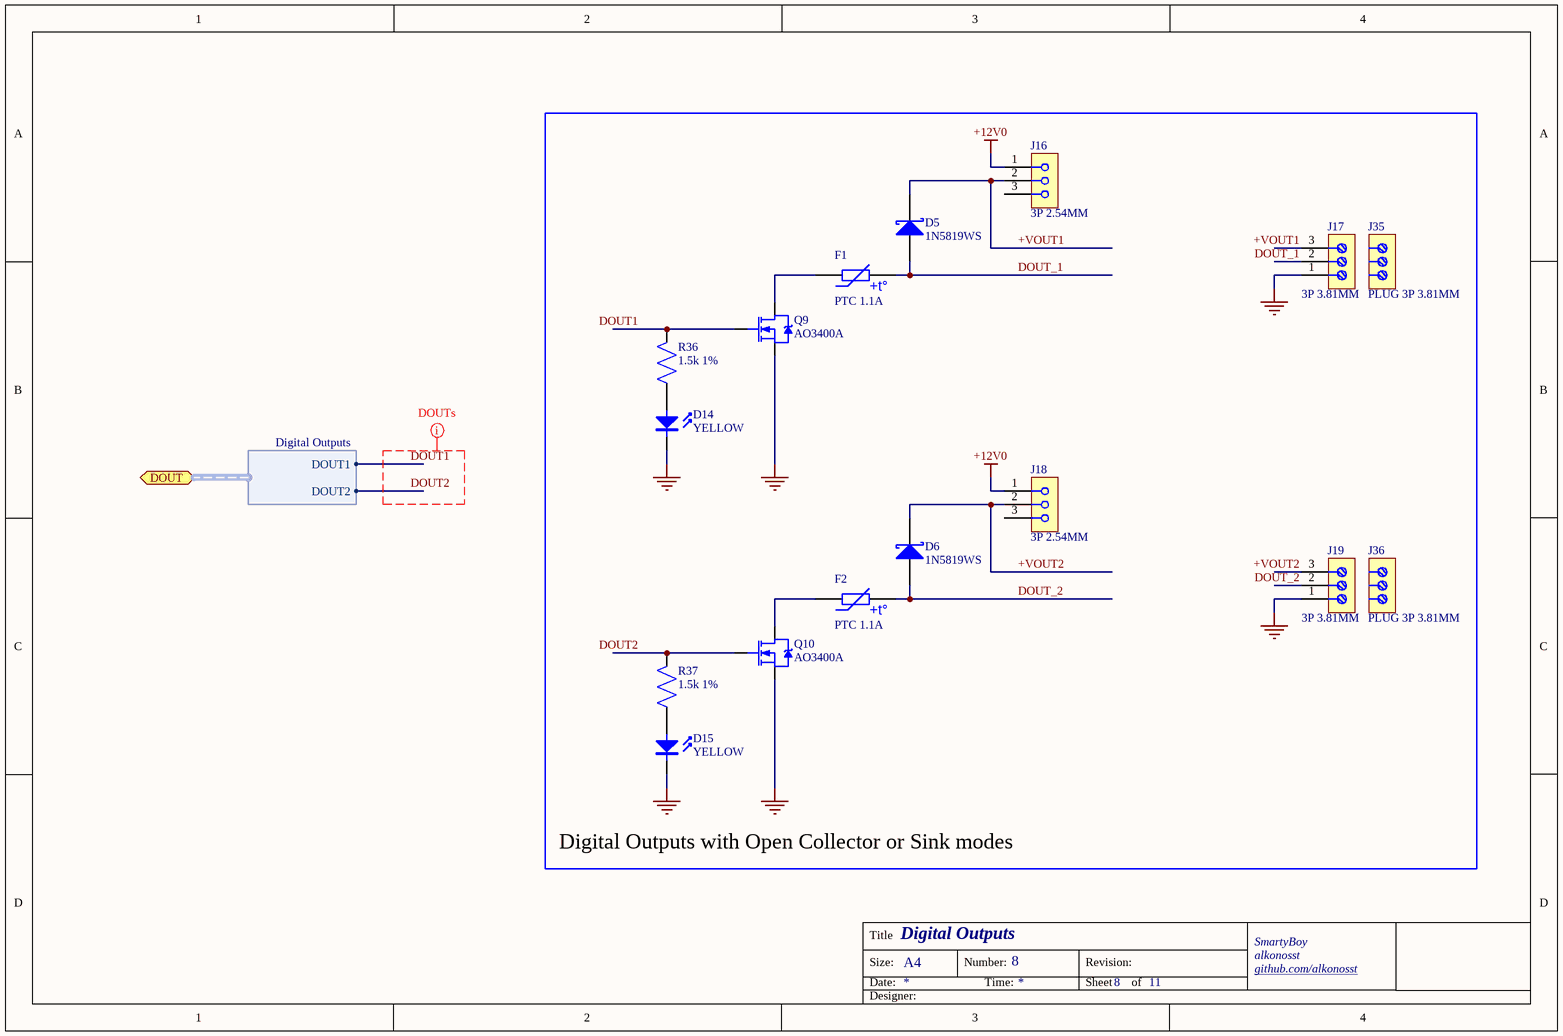
[diagram p9: 7_dout.SchDoc]

### Parts
D5  1N5819WS  [SOD-323]
D6  1N5819WS  [SOD-323]
D14  YELLOW  [LED0603-YELLOW]
D15  YELLOW  [LED0603-YELLOW]
F1  PTC 1.1A  [1812L]
F2  PTC 1.1A  [1812L]
J16  3P 2.54MM  [HDR-M-3P-2.54MM]
J17  3P 3.81MM  [TB-3P-3.81MM]  (no BOM)
J18  3P 2.54MM  [HDR-M-3P-2.54MM]
J19  3P 3.81MM  [TB-3P-3.81MM]  (no BOM)
J35  PLUG 3P 3.81MM  [TB-PLUG-3P-3.81MM]  (no BOM)
J36  PLUG 3P 3.81MM  [TB-PLUG-3P-3.81MM]  (no BOM)
Q9  AO3400A  [SOT-23-3]
Q10  AO3400A  [SOT-23-3]
R36  1.5k 1%  [R0603]
R37  1.5k 1%  [R0603]

### Blocks framed on the sheet
Digital Outputs with Open Collector or Sink modes: D5 D6 D14 D15 F1 F2 J16-J19 J35 J36 Q9 Q10 R36 R37

### Ports
DOUT (bidir, harness Digital Outputs)

### Harnesses
Digital Outputs: DOUT1, DOUT2

### Nets
+12V0: J16.1 J18.1
GND: D14.1 D15.1 J17.1 J19.1 Q9.2(S) Q10.2(S)
+VOUT1: D5.1(K) J16.2 J17.3
+VOUT2: D6.1(K) J18.2 J19.3
DOUT1: Q9.1(G) R36.2 ; port DOUT.DOUT1
DOUT2: Q10.1(G) R37.2 ; port DOUT.DOUT2
DOUT_1: D5.2(A) F1.2 J17.2
DOUT_2: D6.2(A) F2.2 J19.2
NetD14_2: D14.2 R36.1
NetD15_2: D15.2 R37.1
NetF1_1: F1.1 Q9.3(D)
NetF2_1: F2.1 Q10.3(D)

Not connected (* = marked no-connect by the designer): J16 3; J18 3

### Layout directives
net class DOUTs: DOUT1, DOUT2

### Notes on the sheet
- Title
- Size:
- Date:
- A4
- Number:
- Time:
- Revision:
- Sheet
- of
- SmartyBoy
- alkonosst
- github.com/alkonosst <http://github.com/alkonosst>
- Designer:
- (in symbol 1812L110/33MR) +t°

### Library data of the parts
D5 D6 = 1N5819WS: as D1 on sheet 4_adc; LCSC part: C191023; Category: Diodes: Schottky Barrier Diodes (SBD)
D14 D15 = 19-213/Y2C-CQ2R2L/3T(CY): as D10 on sheet 5_dac; LCSC part: C72038; Category: Optoelectronics: Light Emitting Diodes (LED)
F1 F2 = 1812L110/33MR: Polymeric 33V 200mΩ 1.95A 500ms 1812 PTC Resettable Fuses; LCSC part: C142747; Category: Fuses: PTC Resettable Fuses
J16 J18 = C49257: as J9 on sheet 5_dac; LCSC part: C49257; Category: Connectors: Pin Header & Female Header
J17 J19 = TBLOCK-3P-3.81MM: Terminal Block 3 Positions 3.81MM; Category: Connectors: Pluggable System Terminal Block
J35 J36 = PLUG-3P-3.81MM: Terminal block plug 3positions 3.81mm; Category: Connectors: Pluggable System Terminal Block
Q9 Q10 = AO3400A: as Q4 on sheet 5_dac; LCSC part: C20917; Category: Transistors: MOSFETs
R36 R37 = 0603WAF1501T5E: as R12 on sheet 5_dac; LCSC part: C22843; Category: Resistors: Chip Resistor - Surface Mount

## Nets that join several sheets
+3V3: 3_cpu (C6.1 U4.2), 5_dac (C8.1 U7.5 U7.9), 4_adc (C7.1 D1.1 D3.1 U5.8), 1_power (C2.1 R13.2 U1.3), 9_rs485 (C10.1 U10.8), 8_h-bridge (C15.1 U9.4), 2_usb (R1.2 R2.2), 6_din (R21.2 R25.2)
+12V0: 5_dac (J9.3), 4_adc (J3.2 J6.2), 1_power (C1.1 PS1.4 U1.1), 9_rs485 (J22.2), 6_din (J12.2 J14.2), 7_dout (J16.1 J18.1)
GND: 3_cpu (5 pins), 5_dac (14 pins), 4_adc (12 pins), 1_power (5 pins), 9_rs485 (5 pins), 8_h-bridge (9 pins), 2_usb (10 pins), 6_din (J13.1 J15.1 OC1.3 OC2.3), 7_dout (6 pins)
DAC1_I/V: 3_cpu (U4.8), 5_dac (Q5.1 R27.2)
DAC2_I/V: 3_cpu (U4.9), 5_dac (Q8.1 R28.2)
DIN1: 3_cpu (U4.7), 6_din (OC1.4 R21.1)
DIN2: 3_cpu (U4.6), 6_din (OC2.4 R25.1)
DOUT1: 3_cpu (U4.36), 7_dout (Q9.1 R36.2)
DOUT2: 3_cpu (U4.33), 7_dout (Q10.1 R37.2)
ESP32_EN: 3_cpu (U4.3), 2_usb (C5.1 Q2.3 R2.1 SW1.2)
ESP32_GPIO0: 3_cpu (U4.25), 2_usb (Q1.3 R1.1)
H_BRIDGE_IN1: 3_cpu (U4.30), 8_h-bridge (U9.3)
H_BRIDGE_IN2: 3_cpu (U4.29), 8_h-bridge (U9.2)
H_BRIDGE_ISEN: 4_adc (U5.6), 8_h-bridge (R29.2 U9.7)
RS485_EN: 3_cpu (U4.11), 9_rs485 (R33.2 U10.2 U10.3)
SPI_MOSI: 3_cpu (U4.13), 5_dac (U7.8)
SPI_SCK: 3_cpu (U4.14), 5_dac (U7.7)
SPI_SS: 3_cpu (U4.16), 5_dac (U7.6)
UART1_RX: 3_cpu (U4.34), 2_usb (U3.2)
UART1_TX: 3_cpu (U4.35), 2_usb (U3.3)
UART2_RX: 3_cpu (U4.10), 9_rs485 (U10.1)
UART2_TX: 3_cpu (U4.12), 9_rs485 (U10.4)